# EAGLE design Board2 (EAGLE 9.3.2)
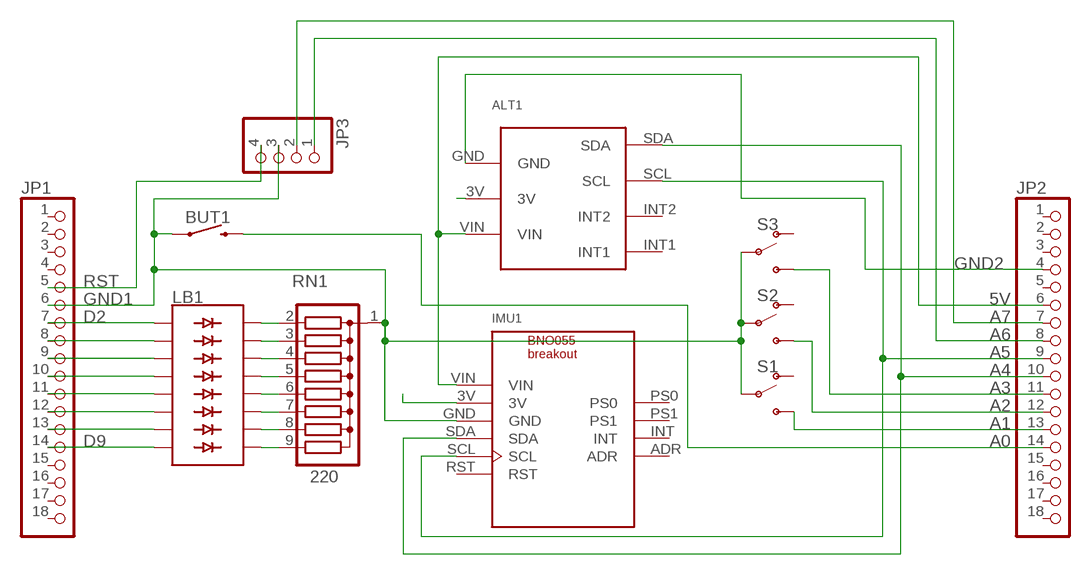
[diagram p0: schematic, sheet 1]

## Parts
ALT1  ADA1893  [ADA1893]
BUT1  MOMENTARY-SWITCH-SPST-PTH-6.0MM  [TACTILE_SWITCH_PTH_6.0MM]
IMU1  ADA2472  [ADA2472]
JP1  PINHD-1X18  [1X18]
JP2  PINHD-1X18  [1X18]
JP3  PINHD-1X4  [1X04]
LB1  LB8  [LB8]
RN1  220  G08R  [SIL9]
S1  SWITCH-SPDT-PTH-11.6X4.0MM  [SWITCH_SPDT_PTH_11.6X4.0MM]
S2  SWITCH-SPDT-PTH-11.6X4.0MM  [SWITCH_SPDT_PTH_11.6X4.0MM]
S3  SWITCH-SPDT-PTH-11.6X4.0MM  [SWITCH_SPDT_PTH_11.6X4.0MM]

## Nets
5V: ALT1.VIN IMU1.VIN JP2.6
A0: BUT1.3 JP2.14
A1: JP2.13 S1.3(S)
A2: JP2.12 S2.3(S)
A3: JP2.11 S3.3(S)
A4: ALT1.SDA IMU1.SDA JP2.10
A5: ALT1.SCL IMU1.SCL JP2.9
A6: JP2.8 JP3.1
A7: JP2.7 JP3.2
D2: JP1.7 LB1.1(A0)
D9: JP1.14 LB1.8(A7)
GND1: BUT1.1 IMU1.GND JP1.6 JP3.3 RN1.1 S1.2(P) S2.2(P) S3.2(P)
GND2: ALT1.GND JP2.4
N$1: IMU1.3V
N$2: JP1.8 LB1.2(A1)
N$3: JP1.9 LB1.3(A2)
N$4: JP1.10 LB1.4(A3)
N$5: JP1.11 LB1.5(A4)
N$6: JP1.12 LB1.6(A5)
N$7: JP1.13 LB1.7(A6)
N$8: ALT1.3V
N$9: LB1.16(C0) RN1.2
N$10: LB1.15(C1) RN1.3
N$11: LB1.14(C2) RN1.4
N$12: LB1.13(C3) RN1.5
N$13: LB1.12(C4) RN1.6
N$14: LB1.11(C5) RN1.7
N$15: LB1.10(C6) RN1.8
N$16: LB1.9(C7) RN1.9
RST: JP1.5 JP3.4
Unconnected: ALT1.INT1 ALT1.INT2 IMU1.ADR IMU1.INT IMU1.PS0 IMU1.PS1 IMU1.RST JP1.1 JP1.2 JP1.3 JP1.4 JP1.15 JP1.16 JP1.17 JP1.18 JP2.1 JP2.2 JP2.3 JP2.5 JP2.15 JP2.16 JP2.17 JP2.18 S1.1(O) S2.1(O) S3.1(O)

## Library data of the parts
ALT1 = cwParts:ADA1893
BUT1 = SparkFun-Switches:MOMENTARY-SWITCH-SPST: Momentary Switch (Pushbutton) - SPST Normally-open (NO) SPST momentary switches (buttons, pushbuttons). Variants PTH-12MM - 12mm square, through-hole Momentary Pushbutton Switch - 12mm Square <https://www.sparkfun.com/products/9190> (COM-09190) PTH-6.0MM, PTH-6.0MM-KIT - 6.0mm square, through-hole Mini Pushbutton Switch <https://www.sparkfun.com/products/97> (COM-00097) KIT package intended for soldering kit's - only one side of pads' copper is exposed. PTH-RIGHT-ANGLE-KIT - Right-angle, through-hole Right Angle Tactile Button <https://www.sparkfun.com/products/10791> - Used on SparkFun BigTime Watch Kit <https://www.sparkfun.com/products/11734> SMD-12MM - 12mm square, surface-mount Tactile Button - SMD (12mm) <https://www.sparkfun.com/products/12993> (COM-12993) Used on SparkFun PicoBoard <https://www.sparkfun.com/products/11888> SMD-4.5MM - 4.5mm Square Trackball Switch Used on SparkFun Blackberry Trackballer Breakout <https://www.sparkfun.com/products/13169> SMD-4.6MMX2.8MM - 4.60mm x 2.80mm, surface mount Used on SparkFun SAMD21 Mini Breakout <https://www.sparkfun.com/products/13664> SMD-5.2MM, SMD-5.2-REDUNDANT - 5.2mm square, surface-mount Mini Pushbutton Switch - SMD <https://www.sparkfun.com/products/8720> (COM-08720) Used on Arduino Pro Mini <https://www.sparkfun.com/products/11114> REDUNDANT package connects both switch circuits together SMD-6.0X3.5MM - 6.0 x 3.5mm, surface mount Momentary Reset Switch SMD <https://www.sparkfun.com/products/8229> (COM-08229) SMD-6.2MM-TALL - 6.2mm square, surface mount Tactile Button - SMD (6mm) <https://www.sparkfun.com/products/12992> Used on SparkFun Digital Sandbox <https://www.sparkfun.com/products/12651> SMD-RIGHT-ANGLE - Right-angle, surface mount Used on SparkFun Block for Intel® Edison - Arduino <https://www.sparkfun.com/products/13036>; PROD_ID: SWCH-08441; SF_SKU: COM-00097
IMU1 = cwParts:ADA2472
JP1 JP2 = pinhead:PINHD-1X18: PIN HEADER
JP3 = pinhead:PINHD-1X4: PIN HEADER
LB1 = cwParts:LB8
RN1 = resistor-sil:G08R: SIL RESISTOR; OC_FARNELL: unknown; OC_NEWARK: unknown
S1-S3 = SparkFun-Switches:SWITCH-SPDT: Single Pole, Double Throw (SPDT) Switch Single-pole, double-throw (SPDT) switch. Variant Overview SMD-AYZ0202 Surface Mount DPDT Switch <https://www.sparkfun.com/products/597> (COM-00597) Used on e.g. LilyPad Arduino USB - ATmega32U4 Board <https://www.sparkfun.com/products/12049> PTH-11.6X4.0MM SPDT Mini Power Switch <https://www.sparkfun.com/products/102> (COM-00102) Used on e.g. SparkFun Simon Says - Through-Hole Soldering Kit <https://www.sparkfun.com/products/10547> (KIT-10547) PTH-11.6X4.0MM-KIT KIT version of SPDT Mini Power Switch - Simplifies soldering by removing tStop of switch pins - only one side can be soldered. PTH-11.6X4.0MM-LOCK LOCK version of SPDT Mini Power Switch - Offset pins hold switch in place for easier soldering. SMD-RIGHT-ANGLE Surface Mount Right Angle Switch <https://www.sparkfun.com/products/10860> (COM-10860) Used on e.g. SparkFun ESP8266 Thing <https://www.sparkfun.com/products/13231>; PROD_ID: SWCH-08261; SF_SKU: COM-00102

## Board
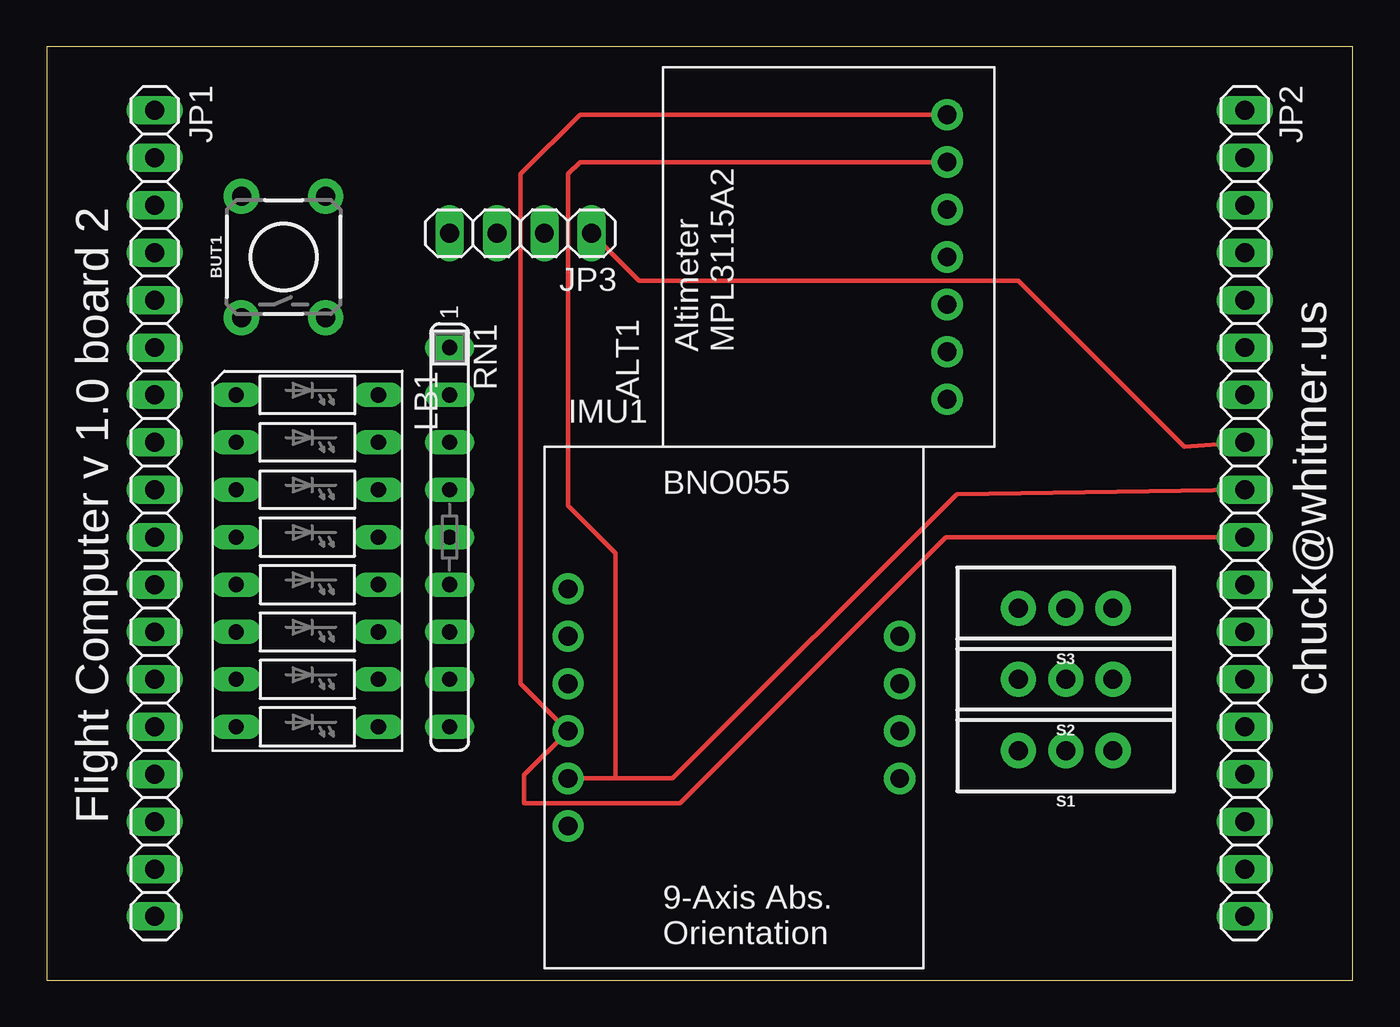
[diagram p1: board, top side]
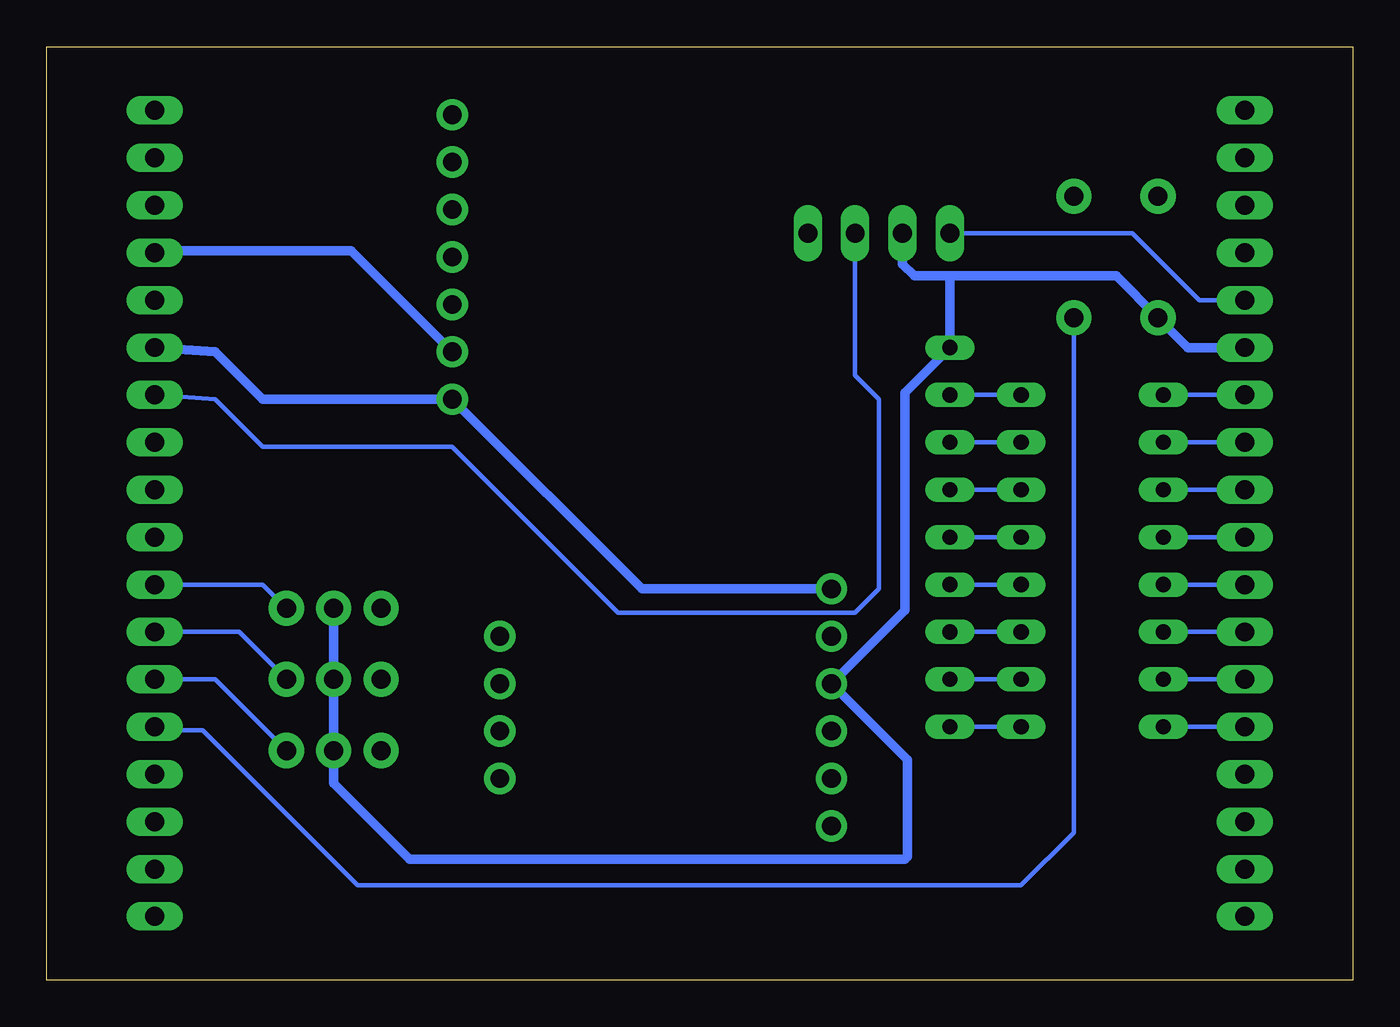
[diagram p2: board, bottom side, seen from below]

Size 70 x 50 mm. Coordinates in mm from the lower left corner, seen from the top.
Outline: 0,0 70,0 70,50 0,50 0,0
Copper layers (1*16): Top 0.035mm / dielectric 1.5mm / Bottom 0.035mm
Design rules "default": minimum track width 6mil, minimum drill 0.35mm, track to track 6mil, track to pad 6mil, pad to pad 6mil, via to via 6mil, smd to smd 6mil, copper to edge 40mil, drill to drill 6mil, minimum pad ring 10mil, minimum via ring 8mil, stop-mask expansion 4mil, vias tented up to drill 0mil, thermal gap 10mil

### Footprints (pad centres in the part's own frame; a part is rotated, then mirrored left to right if it is on the bottom)
ADA1893 = drill 1 pad 1.676: 3V -2.54,-6.35; GND -5.08,-6.35; INT1 2.54,-6.35; INT2 0,-6.35; SCL 5.08,-6.35; SDA 7.62,-6.35; VIN -7.62,-6.35
TACTILE_SWITCH_PTH_6.0MM = drill 1.016 pad 1.88: 1 -3.251,2.261; 2 3.251,2.261; 3 -3.251,-2.261; 4 3.251,-2.261
ADA2472 = drill 1 pad 1.676: 3V -8.89,3.81; ADR 8.89,-3.81; GND -8.89,1.27; INT 8.89,-1.27; PS0 8.89,3.81; PS1 8.89,1.27; RST -8.89,-6.35; SCL -8.89,-3.81; SDA -8.89,-1.27; VIN -8.89,6.35
1X18 = drill 1.016 long: 1 -21.59,0; 2 -19.05,0; 3 -16.51,0; 4 -13.97,0; 5 -11.43,0; 6 -8.89,0; 7 -6.35,0; 8 -3.81,0; 9 -1.27,0; 10 1.27,0; 11 3.81,0; 12 6.35,0; 13 8.89,0; 14 11.43,0; 15 13.97,0; 16 16.51,0; 17 19.05,0; 18 21.59,0
1X04 = drill 1.016 long: 1 -3.81,0; 2 -1.27,0; 3 1.27,0; 4 3.81,0
LB8 = drill 0.813 long: 1 -11.43,-3.81; 2 -8.89,-3.81; 3 -6.35,-3.81; 4 -3.81,-3.81; 5 -1.27,-3.81; 6 1.27,-3.81; 7 3.81,-3.81; 8 6.35,-3.81; 9 6.35,3.81; 10 3.81,3.81; 11 1.27,3.81; 12 -1.27,3.81; 13 -3.81,3.81; 14 -6.35,3.81; 15 -8.89,3.81; 16 -11.43,3.81
SIL9 = drill 0.813 long: 1 -10.16,0; 2 -7.62,0; 3 -5.08,0; 4 -2.54,0; 5 0,0; 6 2.54,0; 7 5.08,0; 8 7.62,0; 9 10.16,0
SWITCH_SPDT_PTH_11.6X4.0MM = drill 1.016 pad 1.88: 1 0,2.54; 2 0,0; 3 0,-2.54

### Placement (x,y rotation side)
ALT1  41.91,38.73 90 top
BUT1  12.7,38.73 90 top
IMU1  36.83,14.61 0 top
JP1  5.79,24.99 270 top
JP2  64.21,24.99 270 top
JP3  25.4,40.01 180 top
LB1  13.97,19.91 270 top
RN1  21.59,23.72 270 top
S1  54.61,12.29 90 top
S2  54.61,16.1 90 top
S3  54.61,19.91 90 top

### Tracks (layer width: path | path; a pad name or v marks a point on that pad's centre or on a via)
5V
  Bottom 0.508: IMU1.VIN 38.1,20.95 ALT1.VIN 58.42,31.11 60.96,33.66 JP2.6
A0
  Bottom 0.254: JP2.14 63.4,13.39 61.65,13.39 53.34,5.08 17.78,5.08 14.96,7.9 BUT1.3
A1
  Bottom 0.254: JP2.13 60.96,16.1 S1.3
A2
  Bottom 0.254: JP2.12 59.69,18.64 S2.3
A3
  Bottom 0.254: JP2.11 58.42,21.18 S3.3
A4
  Top 0.254: 47.9,23.44 47.79,23.33 | 47.79,23.33 33.93,9.47 25.59,9.47 25.59,10.99 IMU1.SDA 25.4,15.88 25.4,43.18 28.57,46.35 ALT1.SDA | JP2.10 48.18,23.72 47.79,23.33
A5
  Top 0.254: 30.48,10.79 33.53,10.79 48.77,26.04 JP2.9 | 30.48,10.79 IMU1.SCL | ALT1.SCL 28.57,43.81 27.94,43.18 27.94,25.4 30.48,22.86 30.48,10.79
A6
  Top 0.254: JP3.1 31.75,37.47 52.07,37.47 60.96,28.57 JP2.8
A7
  Bottom 0.254: JP3.2 26.67,32.38 25.4,31.11 25.4,20.95 26.67,19.68 39.37,19.68 48.26,28.57 58.42,28.57 60.96,31.11 JP2.7
D2
  Bottom 0.254: JP1.7 LB1.1
D9
  Bottom 0.254: JP1.14 LB1.8
GND1
  Bottom 0.152: 23.88,6.6 24,6.48
  Bottom 0.508: JP1.6 8.84,33.88 BUT1.1 12.68,37.72 21.59,37.72 | JP3.3 24.13,38.35 23.5,37.72 21.59,37.72 | 21.59,37.72 RN1.1 24,31.47 24,19.81 IMU1.GND 23.88,11.81 23.88,6.6 | 24,6.48 50.55,6.48 54.61,10.54 S1.2 S2.2 S3.2
GND2
  Bottom 0.152: JP2.4 64.11,39.06
  Bottom 0.508: 64.11,39.06 53.67,39.06 ALT1.GND
N$2
  Bottom 0.254: JP1.8 LB1.2
N$3
  Bottom 0.254: JP1.9 LB1.3
N$4
  Bottom 0.254: JP1.10 LB1.4
N$5
  Bottom 0.254: JP1.11 LB1.5
N$6
  Bottom 0.254: JP1.12 LB1.6
N$7
  Bottom 0.254: JP1.13 LB1.7
N$9
  Bottom 0.254: LB1.16 RN1.2
N$10
  Bottom 0.254: RN1.3 LB1.15
N$11
  Bottom 0.254: LB1.14 RN1.4
N$12
  Bottom 0.254: RN1.5 LB1.13
N$13
  Bottom 0.254: LB1.12 RN1.6
N$14
  Bottom 0.254: RN1.7 LB1.11
N$15
  Bottom 0.254: LB1.10 RN1.8
N$16
  Bottom 0.254: RN1.9 LB1.9
RST
  Bottom 0.254: JP1.5 8.23,36.42 11.81,40.01 JP3.4

### Text on the board
tNames: chuck@whitmer.us | Flight Computer v 1.0 board 2